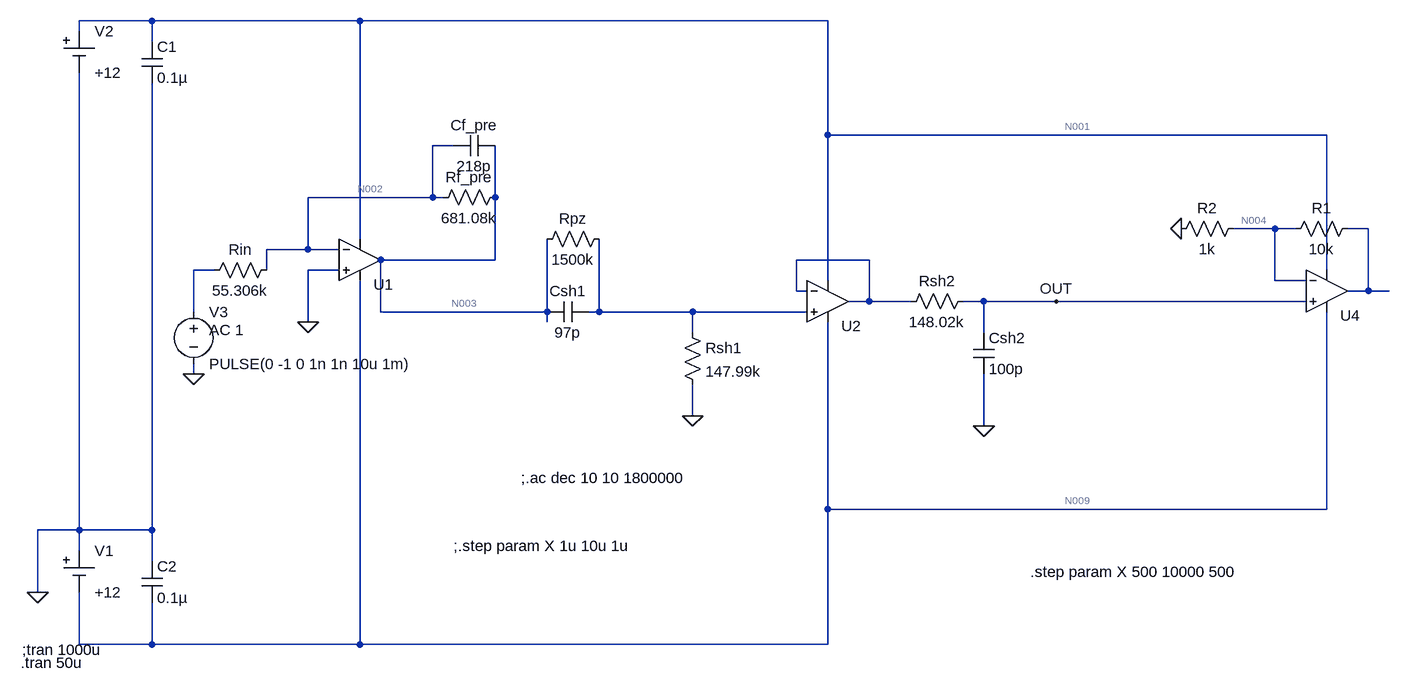
[diagram p0: schematic Circ_5.asc]
Circ_5.asc, the LTspice schematic file:
Version 4
SHEET 1 2336 680
WIRE -432 -624 -544 -624
WIRE -112 -624 -432 -624
WIRE 608 -624 -112 -624
WIRE -544 -608 -544 -624
WIRE -432 -592 -432 -624
WIRE 608 -448 608 -624
WIRE 1376 -448 608 -448
WIRE 32 -432 0 -432
WIRE 0 -352 0 -432
WIRE 0 -352 -192 -352
WIRE 16 -352 0 -352
WIRE 96 -352 96 -432
WIRE 1296 -304 1232 -304
WIRE 1328 -304 1296 -304
WIRE 1440 -304 1408 -304
WIRE -112 -288 -112 -624
WIRE -192 -272 -192 -352
WIRE -192 -272 -256 -272
WIRE -144 -272 -192 -272
WIRE 96 -256 96 -352
WIRE 96 -256 -80 -256
WIRE 672 -256 560 -256
WIRE -336 -240 -368 -240
WIRE -256 -240 -256 -272
WIRE -144 -240 -192 -240
WIRE 1376 -240 1376 -448
WIRE 608 -224 608 -448
WIRE 1296 -224 1296 -304
WIRE 1344 -224 1296 -224
WIRE 560 -208 560 -256
WIRE 576 -208 560 -208
WIRE 1440 -208 1440 -304
WIRE 1440 -208 1408 -208
WIRE 1472 -208 1440 -208
WIRE 672 -192 672 -256
WIRE 672 -192 640 -192
WIRE 736 -192 672 -192
WIRE 848 -192 816 -192
WIRE 960 -192 848 -192
WIRE 1344 -192 960 -192
WIRE -368 -176 -368 -240
WIRE -80 -176 -80 -256
WIRE 176 -176 176 -288
WIRE 176 -176 -80 -176
WIRE 256 -176 256 -288
WIRE 256 -176 240 -176
WIRE 400 -176 256 -176
WIRE 576 -176 400 -176
WIRE -192 -160 -192 -240
WIRE 176 -160 176 -176
WIRE 400 -144 400 -176
WIRE 848 -144 848 -192
WIRE -368 -80 -368 -96
WIRE 400 -16 400 -64
WIRE 848 0 848 -80
WIRE 608 128 608 -160
WIRE 1376 128 1376 -176
WIRE 1376 128 608 128
WIRE -544 160 -544 -544
WIRE -544 160 -608 160
WIRE -432 160 -432 -528
WIRE -432 160 -544 160
WIRE -544 192 -544 160
WIRE -432 208 -432 160
WIRE -608 256 -608 160
WIRE -544 336 -544 256
WIRE -432 336 -432 272
WIRE -432 336 -544 336
WIRE -112 336 -112 -224
WIRE -112 336 -432 336
WIRE 608 336 608 128
WIRE 608 336 -112 336
FLAG -608 256 0
FLAG 400 -16 0
FLAG 848 0 0
FLAG 960 -192 OUT
FLAG -368 -80 0
FLAG -192 -160 0
FLAG 1152 -304 0
SYMBOL cap -448 208 R0
SYMATTR InstName C2
SYMATTR Value 0.1µ
SYMBOL Misc\\cell -544 192 R0
WINDOW 123 0 0 Left 0
WINDOW 39 0 0 Left 0
SYMATTR InstName V1
SYMATTR Value +12
SYMBOL Misc\\cell -544 -608 R0
WINDOW 123 0 0 Left 0
WINDOW 39 0 0 Left 0
SYMATTR InstName V2
SYMATTR Value +12
SYMBOL cap -448 -592 R0
SYMATTR InstName C1
SYMATTR Value 0.1µ
SYMBOL Opamps/UniversalOpamp2 608 -192 R0
WINDOW 0 21 38 Left 2
SYMATTR InstName U2
SYMBOL cap 240 -192 R90
WINDOW 0 0 32 VBottom 2
WINDOW 3 32 32 VTop 2
SYMATTR InstName Csh1
SYMATTR Value 97p
SYMBOL res 384 -160 R0
SYMATTR InstName Rsh1
SYMATTR Value 147.99k
SYMBOL res 832 -208 R90
WINDOW 0 0 56 VBottom 2
WINDOW 3 32 56 VTop 2
SYMATTR InstName Rsh2
SYMATTR Value 148.02k
SYMBOL cap 832 -144 R0
SYMATTR InstName Csh2
SYMATTR Value 100p
SYMBOL Opamps/UniversalOpamp2 -112 -256 R0
WINDOW 0 21 38 Left 2
SYMATTR InstName U1
SYMBOL res 112 -368 R90
WINDOW 0 0 56 VBottom 2
WINDOW 3 32 56 VTop 2
SYMATTR InstName Rf_pre
SYMATTR Value 681.08k
SYMBOL cap 96 -448 R90
WINDOW 0 0 32 VBottom 2
WINDOW 3 32 32 VTop 2
SYMATTR InstName Cf_pre
SYMATTR Value 218p
SYMBOL res -240 -256 R90
WINDOW 0 0 56 VBottom 2
WINDOW 3 32 56 VTop 2
SYMATTR InstName Rin
SYMATTR Value 55.306k
SYMBOL voltage -368 -192 R0
WINDOW 123 24 44 Left 2
WINDOW 39 0 0 Left 0
SYMATTR Value2 AC 1
SYMATTR InstName V3
SYMATTR Value PULSE(0 -1 0 1n 1n 10u 1m)
SYMBOL res 272 -304 R90
WINDOW 0 0 56 VBottom 2
WINDOW 3 32 56 VTop 2
SYMATTR InstName Rpz
SYMATTR Value 1500k
SYMBOL Opamps/UniversalOpamp2 1376 -208 R0
WINDOW 0 21 38 Left 2
SYMATTR InstName U4
SYMBOL res 1424 -320 R90
WINDOW 0 0 56 VBottom 2
WINDOW 3 32 56 VTop 2
SYMATTR InstName R1
SYMATTR Value 10k
SYMBOL res 1248 -320 R90
WINDOW 0 0 56 VBottom 2
WINDOW 3 32 56 VTop 2
SYMATTR InstName R2
SYMATTR Value 1k
TEXT -632 344 Left 2 !;tran 1000u
TEXT 32 184 Left 2 !;.step param X 1u 10u 1u
TEXT 920 224 Left 2 !.step param X 500 10000 500
TEXT 136 80 Left 2 !;.ac dec 10 10 1800000
TEXT -634 364 Left 2 !.tran 50u

The netlist it stands for:
* Circ_5.asc
C2 0 N009 0.1µ
V1 0 N009 +12
V2 N001 0 +12
C1 N001 0 0.1µ
XU2 N008 N006 N001 N009 N006 level.2 Avol=1Meg GBW=10Meg Slew=10Meg ilimit=25m rail=0 Vos=0 phimargin=45 en=0 enk=0 in=0 ink=0 Rin=500Meg  ; pins IN+ IN- V+ V- OUT
Csh1 N008 N003 97p
Rsh1 N008 0 147.99k
Rsh2 OUT N006 148.02k
Csh2 OUT 0 100p
XU1 0 N002 N001 N009 N003 level.2 Avol=1Meg GBW=10Meg Slew=10Meg ilimit=25m rail=0 Vos=0 phimargin=45 en=0 enk=0 in=0 ink=0 Rin=500Meg  ; pins IN+ IN- V+ V- OUT
Rf_pre N003 N002 681.08k
Cf_pre N003 N002 218p
Rin N002 N007 55.306k
V3 N007 0 PULSE(0 -1 0 1n 1n 10u 1m) AC 1
Rpz N008 N003 1500k
XU4 OUT N004 N001 N009 N005 level.2 Avol=1Meg GBW=10Meg Slew=10Meg ilimit=25m rail=0 Vos=0 phimargin=45 en=0 enk=0 in=0 ink=0 Rin=500Meg  ; pins IN+ IN- V+ V- OUT
R1 N005 N004 10k
R2 N004 0 1k
;tran 1000u
;.step param X 1u 10u 1u
.step param X 500 10000 500
;.ac dec 10 10 1800000
.tran 50u
.lib UniversalOpamps2.sub
.backanno
.end

* Results of the author's LTspice run, read from the files saved beside the schematic
* Operating Point (first step), zero values left out:
*   x = 500 
*   V(n009) = -12 V
*   V(n001) = 12 V
*   I(V2) = -3.6 mA
*   I(V1) = -3.6 mA
*   Ix(u2:3) = 1.2 mA
*   Ix(u2:4) = -1.2 mA
*   Ix(u1:3) = 1.2 mA
*   Ix(u1:4) = -1.2 mA
*   Ix(u4:3) = 1.2 mA
*   Ix(u4:4) = -1.2 mA
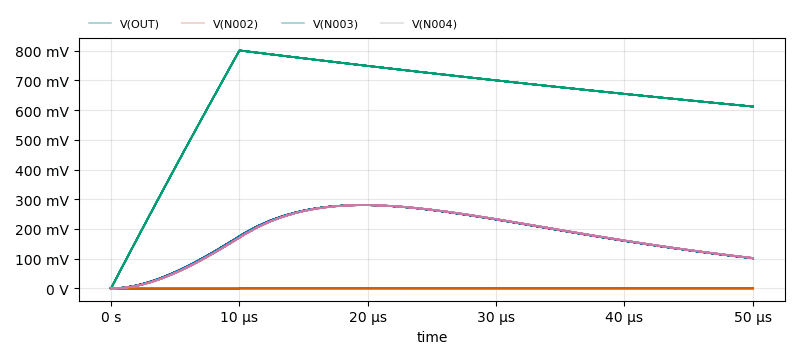
[diagram p1: Transient Analysis of Circ_5.asc, plotted from the saved traces]
* Transient Analysis, 20 runs:
*   V(OUT) [run 1]: min 0 V, max 280.3 mV, average 180.2 mV, rms 197.4 mV, last 101.1 mV
*   V(OUT) [run 2]: min 0 V, max 280.3 mV, average 180.2 mV, rms 197.4 mV, last 101.1 mV
*   V(OUT) [run 3]: min 0 V, max 280.3 mV, average 180.2 mV, rms 197.4 mV, last 101.1 mV
*   V(OUT) [run 4]: min 0 V, max 280.3 mV, average 180.2 mV, rms 197.4 mV, last 101.1 mV
*   V(OUT) [run 5]: min 0 V, max 280.3 mV, average 180.2 mV, rms 197.4 mV, last 101.1 mV
*   V(OUT) [run 6]: min 0 V, max 280.3 mV, average 180.2 mV, rms 197.4 mV, last 101.1 mV
*   V(OUT) [run 7]: min 0 V, max 280.3 mV, average 180.2 mV, rms 197.4 mV, last 101.1 mV
*   V(OUT) [run 8]: min 0 V, max 280.3 mV, average 180.2 mV, rms 197.4 mV, last 101.1 mV
*   V(N002) [run 1]: min -1.681 mV, max 495 µV, average -195.6 µV, rms 575.7 µV, last 64.96 µV
*   V(N002) [run 2]: min -1.681 mV, max 495 µV, average -195.6 µV, rms 575.7 µV, last 64.96 µV
*   V(N002) [run 3]: min -1.681 mV, max 495 µV, average -195.6 µV, rms 575.7 µV, last 64.96 µV
*   V(N002) [run 4]: min -1.681 mV, max 495 µV, average -195.6 µV, rms 575.7 µV, last 64.96 µV
*   V(N002) [run 5]: min -1.681 mV, max 495 µV, average -195.6 µV, rms 575.7 µV, last 64.96 µV
*   V(N002) [run 6]: min -1.681 mV, max 495 µV, average -195.6 µV, rms 575.7 µV, last 64.96 µV
*   V(N002) [run 7]: min -1.681 mV, max 495 µV, average -195.6 µV, rms 575.7 µV, last 64.96 µV
*   V(N002) [run 8]: min -1.681 mV, max 495 µV, average -195.6 µV, rms 575.7 µV, last 64.96 µV
*   V(N003) [run 1]: min -72.45 µV, max 801.4 mV, average 642.7 mV, rms 663.8 mV, last 612.2 mV
*   V(N003) [run 2]: min -72.45 µV, max 801.4 mV, average 642.7 mV, rms 663.8 mV, last 612.2 mV
*   V(N003) [run 3]: min -72.45 µV, max 801.4 mV, average 642.7 mV, rms 663.8 mV, last 612.2 mV
*   V(N003) [run 4]: min -72.45 µV, max 801.4 mV, average 642.7 mV, rms 663.8 mV, last 612.2 mV
*   V(N003) [run 5]: min -72.45 µV, max 801.4 mV, average 642.7 mV, rms 663.8 mV, last 612.2 mV
*   V(N003) [run 6]: min -72.45 µV, max 801.4 mV, average 642.7 mV, rms 663.8 mV, last 612.2 mV
*   V(N003) [run 7]: min -72.45 µV, max 801.4 mV, average 642.7 mV, rms 663.8 mV, last 612.2 mV
*   V(N003) [run 8]: min -72.45 µV, max 801.4 mV, average 642.7 mV, rms 663.8 mV, last 612.2 mV
*   V(N004) [run 1]: min 0 V, max 280.2 mV, average 179.9 mV, rms 197.3 mV, last 102 mV
*   V(N004) [run 2]: min 0 V, max 280.2 mV, average 179.9 mV, rms 197.3 mV, last 102 mV
*   V(N004) [run 3]: min 0 V, max 280.2 mV, average 179.9 mV, rms 197.3 mV, last 102 mV
*   V(N004) [run 4]: min 0 V, max 280.2 mV, average 179.9 mV, rms 197.3 mV, last 102 mV
*   V(N004) [run 5]: min 0 V, max 280.2 mV, average 179.9 mV, rms 197.3 mV, last 102 mV
*   V(N004) [run 6]: min 0 V, max 280.2 mV, average 179.9 mV, rms 197.3 mV, last 102 mV
*   V(N004) [run 7]: min 0 V, max 280.2 mV, average 179.9 mV, rms 197.3 mV, last 102 mV
*   V(N004) [run 8]: min 0 V, max 280.2 mV, average 179.9 mV, rms 197.3 mV, last 102 mV